# EAGLE schematic instrumentation_amplifier (EAGLE 9.3.1)
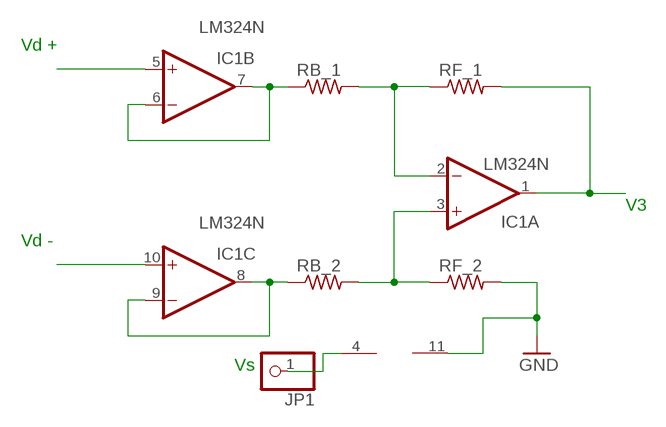
[diagram p0: schematic, sheet 1]

## Parts
IC1  LM324N  [DIL14]
JP1  PINHD-1X1  [1X01]
RB_1  R-US_0309/10  [0309/10]
RB_2  R-US_0309/10  [0309/10]
RF_1  R-US_0309/10  [0309/10]
RF_2  R-US_0309/10  [0309/10]

## Nets
GND: IC1.11(P:V-) RF_2.2
N$1: IC1.4(P:V+) JP1.1
N$3: IC1.3(A:+IN) RB_2.2 RF_2.1
N$4: IC1.8(C:OUT) IC1.9(C:-IN) RB_2.1
N$5: IC1.6(B:-IN) IC1.7(B:OUT) RB_1.1
N$6: IC1.2(A:-IN) RB_1.2 RF_1.1
N$7: IC1.1(A:OUT) RF_1.2
N$8: IC1.5(B:+IN)
N$9: IC1.10(C:+IN)
Unconnected: IC1.12(D:+IN) IC1.13(D:-IN) IC1.14(D:OUT)

## Notes on the sheet
- Vd +
- V3
- Vd -
- Vs

## Library data of the parts
IC1 = linear:LM324: OP AMP
JP1 = pinhead:PINHD-1X1: PIN HEADER
RB_1 RB_2 RF_1 RF_2 = rcl:R-US_: RESISTOR, American symbol; SPICEPREFIX: R